# EasyEDA Pro project 嵌赛底板.eprj

# Schematic Schematic1
Create Date: 2024-06-25; Page Name: P1; Project Name: 嵌赛底板; Schematic Name: Schematic1; Update Date: 2024-06-25; Company: 嘉立创EDA; Page Size: A4; Version: V1.0
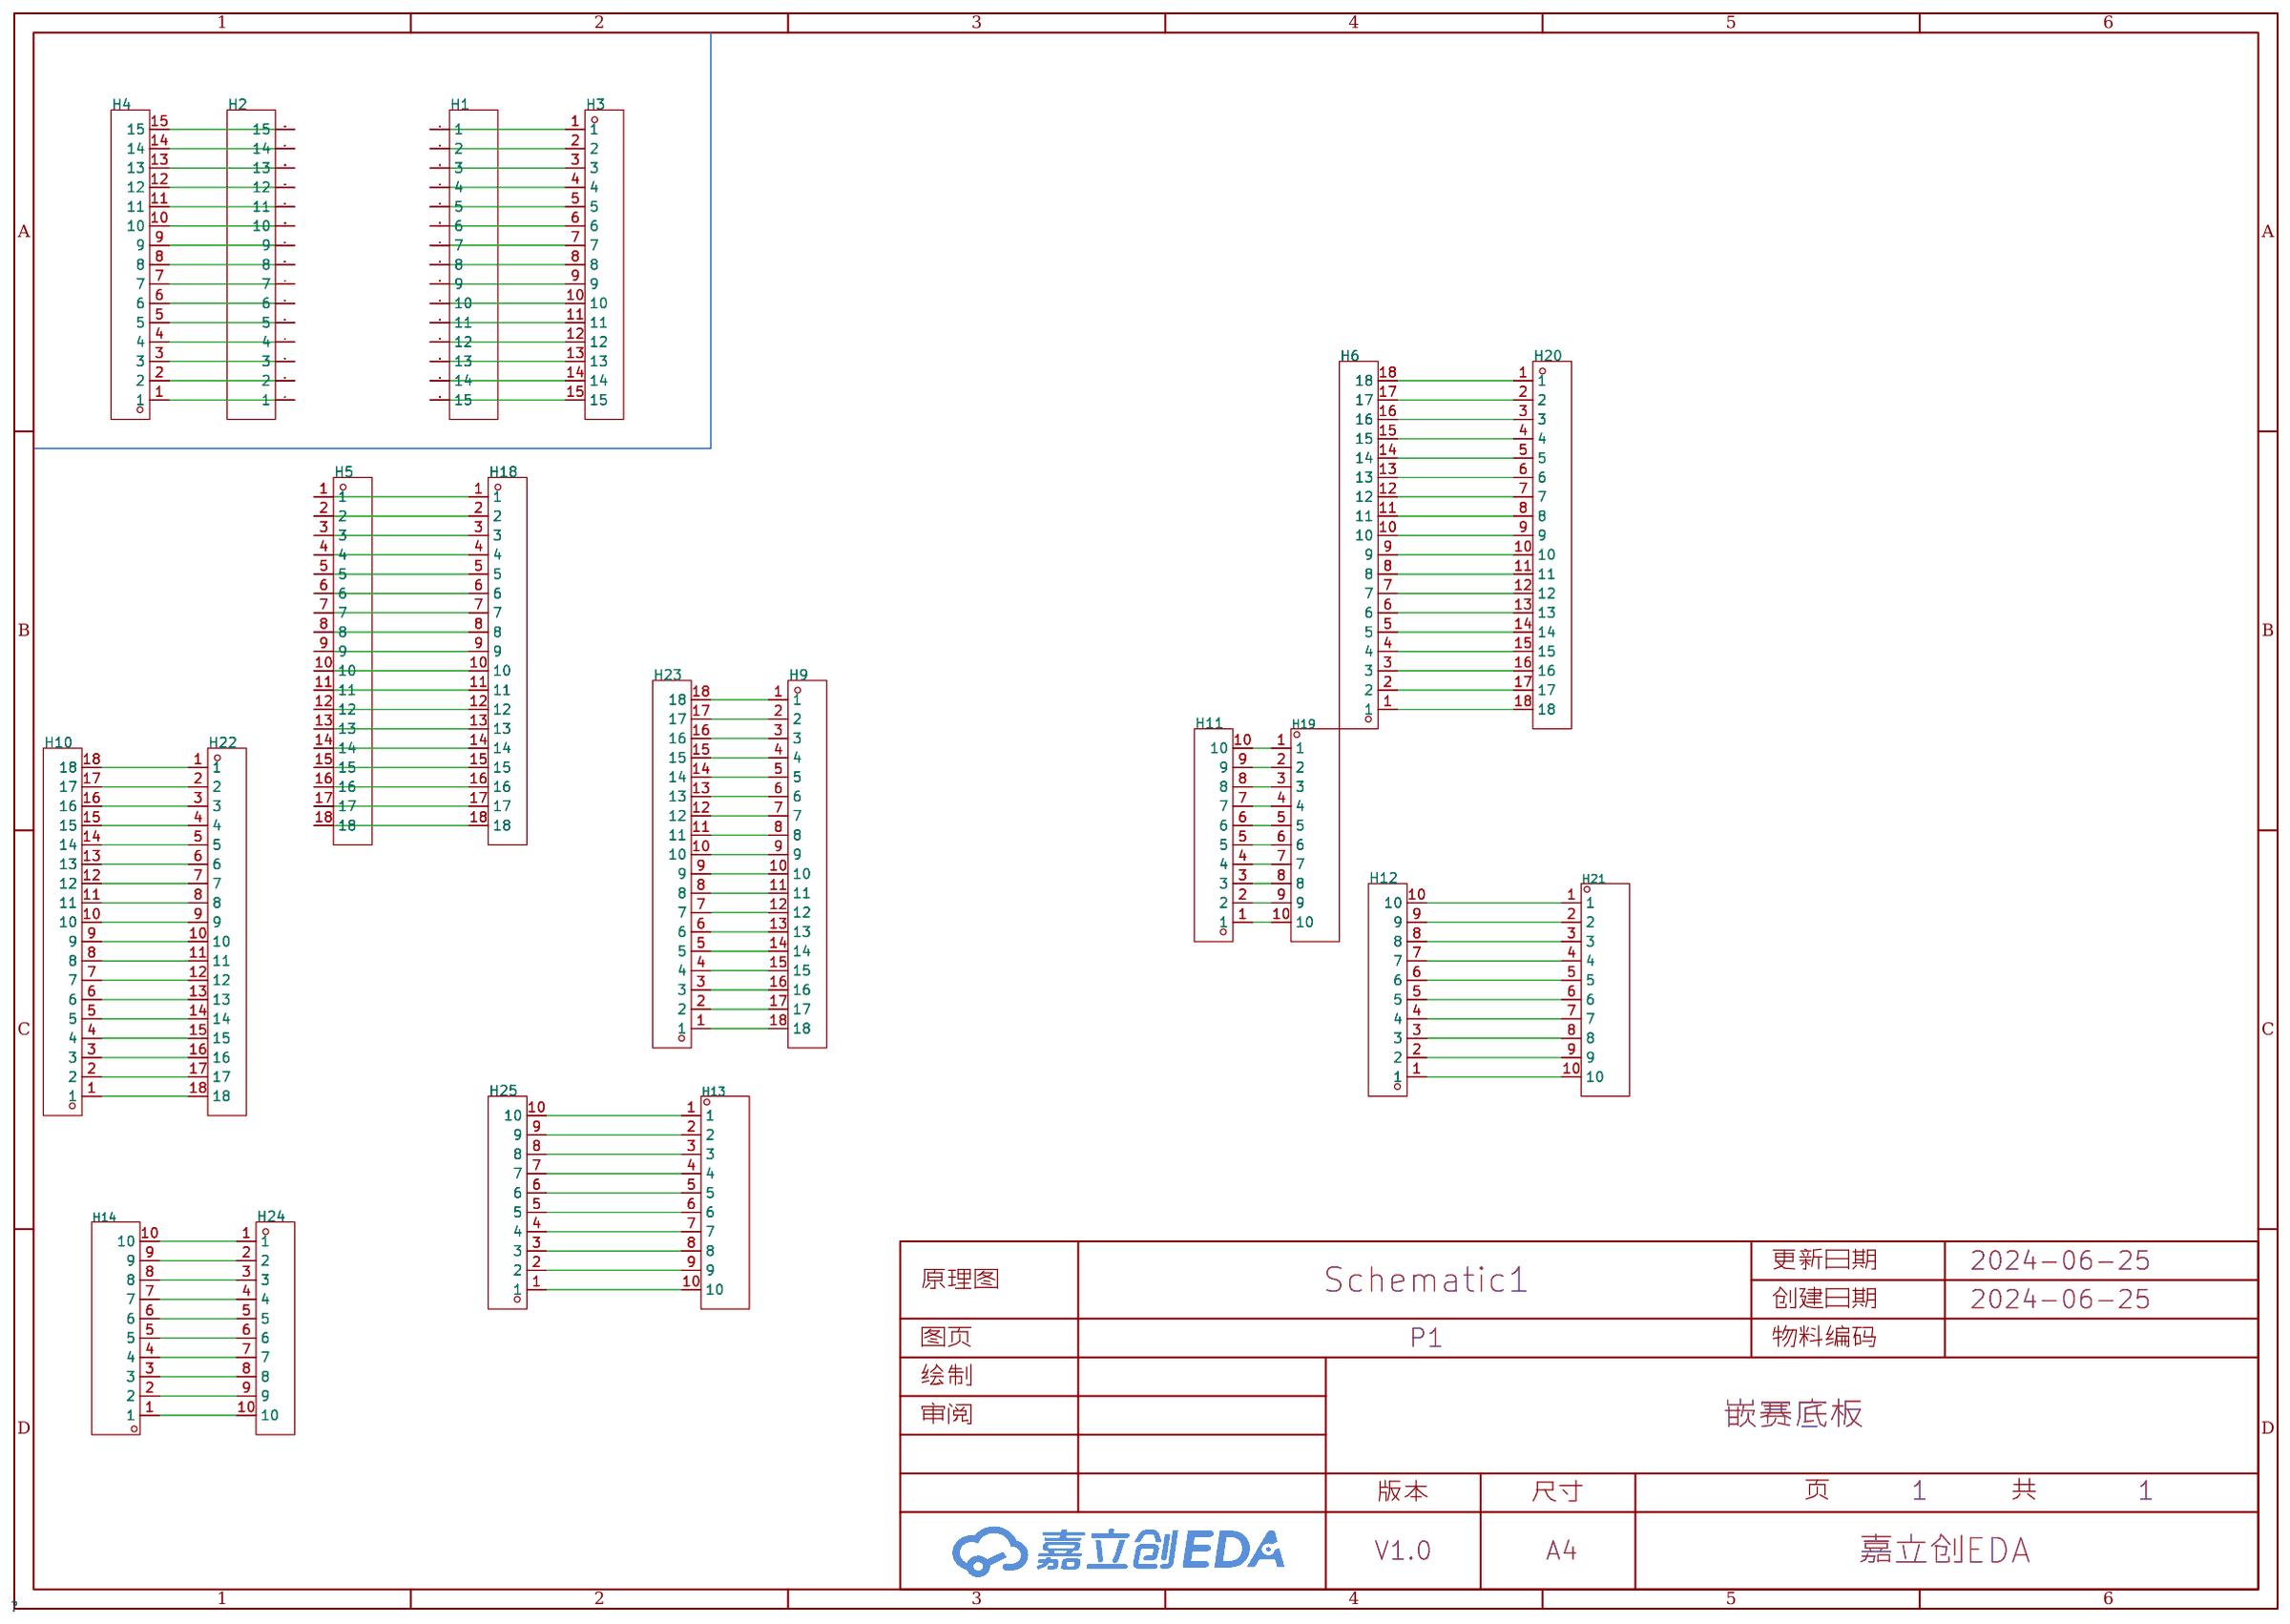
[diagram p0: schematic sheet]

## Parts
H1  -  [HDR-TH_15P-P2.54-V-F-1]
H2  -  [HDR-TH_15P-P2.54-V-F-1]
H3  -  [HDR-TH_15P-P2.54-V-M]
H4  -  [HDR-TH_15P-P2.54-V-M]
H5  -  [HDR-TH_18P-P2.54-V-F]
H6  -  [HDR-TH_18P-P2.54-V-F]
H9  -  [HDR-TH_18P-P2.54-V-M]
H10  -  [HDR-TH_18P-P2.54-V-M]
H11  -  [HDR-TH_10P-P2.54-V-F]
H12  -  [HDR-TH_10P-P2.54-V-F]
H13  -  [HDR-TH_10P-P2.54-V-M-1]
H14  -  [HDR-TH_10P-P2.54-V-M-1]
H18  -  [HDR-TH_18P-P2.54-V-M]
H19  -  [HDR-TH_10P-P2.54-V-M-1]
H20  -  [HDR-TH_18P-P2.54-V-M]
H21  -  [HDR-TH_10P-P2.54-V-M-1]
H22  -  [HDR-TH_18P-P2.54-V-F]
H23  -  [HDR-TH_18P-P2.54-V-F]
H24  -  [HDR-TH_10P-P2.54-V-F]
H25  -  [HDR-TH_10P-P2.54-V-F]

## Library data of the parts
H1 H2 = HDR-F_2.54_1x15P: Supplier Part: C124408; Supplier Footprint: 插件,
H3 H4 = HDR-M_2.54_1x15P: 间距:2.54mm;总PIN位数:15;排数:1;插针结构:1x15P;行距:-;安装类型:直插;圆针/方针:-;额定电流:-;额定电压:-;配合针长度:6mm;塑高:2.54mm;端接针长度:3mm;触头材质:黄铜;触头镀层:-;工作温度范围:-40℃~+105℃;颜色:黑色;; Supplier Part: C124373; Supplier Footprint: 插件
H5 H6 H22 H23 = HDR-F_2.54_1x18P: Supplier Part: C2897381; Supplier Footprint: 插件
H9 H10 H18 H20 = HDR-M_2.54_1x18P: 间距:2.54mm;总PIN位数:18;排数:1;插针结构:1x18P;行距:-;安装类型:直插;圆针/方针:方针;额定电流:3A;额定电压:-;配合针长度:6mm;塑高:2.5mm;端接针长度:3mm;触头材质:-;工作温度范围:-40℃~+105℃;颜色:黑色;; Supplier Part: C2894941; Supplier Footprint: 插件
H11 H12 H24 H25 = HDR-F_2.54_1x10P: Supplier Part: C2684744; Supplier Footprint: 插件
H13 H14 H19 H21 = HDR-M_2.54_1x10P: Supplier Part: C57369; Supplier Footprint: 插件

## Nets
$1N883: H1.1 H3.1
$1N885: H1.2 H3.2
$1N887: H1.3 H3.3
$1N889: H1.4 H3.4
$1N891: H1.5 H3.5
$1N893: H1.6 H3.6
$1N895: H1.7 H3.7
$1N897: H1.8 H3.8
$1N899: H1.9 H3.9
$1N901: H1.10 H3.10
$1N903: H1.11 H3.11
$1N905: H1.12 H3.12
$1N907: H1.13 H3.13
$1N909: H1.14 H3.14
$1N911: H1.15 H3.15
$1N913: H2.1 H4.1
$1N915: H2.2 H4.2
$1N917: H2.3 H4.3
$1N919: H2.4 H4.4
$1N921: H2.5 H4.5
$1N923: H2.6 H4.6
$1N925: H2.7 H4.7
$1N927: H2.8 H4.8
$1N929: H2.9 H4.9
$1N931: H2.10 H4.10
$1N933: H2.11 H4.11
$1N935: H2.12 H4.12
$1N937: H2.13 H4.13
$1N939: H2.14 H4.14
$1N941: H2.15 H4.15
$1N2451: H5.1 H18.1
$1N2453: H5.2 H18.2
$1N2455: H5.3 H18.3
$1N2457: H5.4 H18.4
$1N2459: H5.5 H18.5
$1N2461: H5.6 H18.6
$1N2463: H5.7 H18.7
$1N2465: H5.8 H18.8
$1N2467: H5.9 H18.9
$1N2469: H5.10 H18.10
$1N2471: H5.11 H18.11
$1N2473: H5.12 H18.12
$1N2475: H5.13 H18.13
$1N2477: H5.14 H18.14
$1N2479: H5.15 H18.15
$1N2481: H5.16 H18.16
$1N2483: H5.17 H18.17
$1N2485: H5.18 H18.18
$1N2853: H9.1 H23.18
$1N2855: H9.2 H23.17
$1N2857: H9.3 H23.16
$1N2859: H9.4 H23.15
$1N2861: H9.5 H23.14
$1N2863: H9.6 H23.13
$1N2865: H9.7 H23.12
$1N2867: H9.8 H23.11
$1N2869: H9.9 H23.10
$1N2871: H9.10 H23.9
$1N2873: H9.11 H23.8
$1N2875: H9.12 H23.7
$1N2877: H9.13 H23.6
$1N2879: H9.14 H23.5
$1N2881: H9.15 H23.4
$1N2883: H9.16 H23.3
$1N2885: H9.17 H23.2
$1N2887: H9.18 H23.1
$1N2909: H11.1 H19.10
$1N2911: H11.2 H19.9
$1N2913: H11.3 H19.8
$1N2915: H11.4 H19.7
$1N2917: H11.5 H19.6
$1N2919: H11.6 H19.5
$1N2921: H11.7 H19.4
$1N2923: H11.8 H19.3
$1N2925: H11.9 H19.2
$1N2927: H11.10 H19.1
$1N2929: H13.10 H25.1
$1N2931: H13.9 H25.2
$1N2933: H13.8 H25.3
$1N2935: H13.7 H25.4
$1N2937: H13.6 H25.5
$1N2939: H13.5 H25.6
$1N2941: H13.4 H25.7
$1N2943: H13.3 H25.8
$1N2945: H13.2 H25.9
$1N2947: H13.1 H25.10
$1N2976: H14.10 H24.1
$1N2978: H14.9 H24.2
$1N2980: H14.8 H24.3
$1N2982: H14.7 H24.4
$1N2984: H14.6 H24.5
$1N2986: H14.5 H24.6
$1N2988: H14.4 H24.7
$1N2990: H14.3 H24.8
$1N2992: H14.2 H24.9
$1N2994: H14.1 H24.10
$1N3028: H12.1 H21.10
$1N3030: H12.2 H21.9
$1N3032: H12.3 H21.8
$1N3034: H12.4 H21.7
$1N3036: H12.5 H21.6
$1N3038: H12.6 H21.5
$1N3040: H12.7 H21.4
$1N3042: H12.8 H21.3
$1N3044: H12.9 H21.2
$1N3046: H12.10 H21.1
$1N3048: H6.18 H20.1
$1N3050: H6.17 H20.2
$1N3052: H6.16 H20.3
$1N3054: H6.15 H20.4
$1N3056: H6.14 H20.5
$1N3058: H6.13 H20.6
$1N3060: H6.12 H20.7
$1N3062: H6.11 H20.8
$1N3064: H6.10 H20.9
$1N3066: H6.9 H20.10
$1N3068: H6.8 H20.11
$1N3070: H6.7 H20.12
$1N3072: H6.6 H20.13
$1N3074: H6.5 H20.14
$1N3076: H6.4 H20.15
$1N3078: H6.3 H20.16
$1N3080: H6.2 H20.17
$1N3082: H6.1 H20.18
$1N3084: H10.1 H22.18
$1N3086: H10.2 H22.17
$1N3088: H10.3 H22.16
$1N3090: H10.4 H22.15
$1N3092: H10.5 H22.14
$1N3094: H10.6 H22.13
$1N3096: H10.7 H22.12
$1N3098: H10.8 H22.11
$1N3100: H10.9 H22.10
$1N3102: H10.10 H22.9
$1N3104: H10.11 H22.8
$1N3106: H10.12 H22.7
$1N3108: H10.13 H22.6
$1N3110: H10.14 H22.5
$1N3112: H10.15 H22.4
$1N3114: H10.16 H22.3
$1N3116: H10.17 H22.2
$1N3118: H10.18 H22.1

# Board PCB1
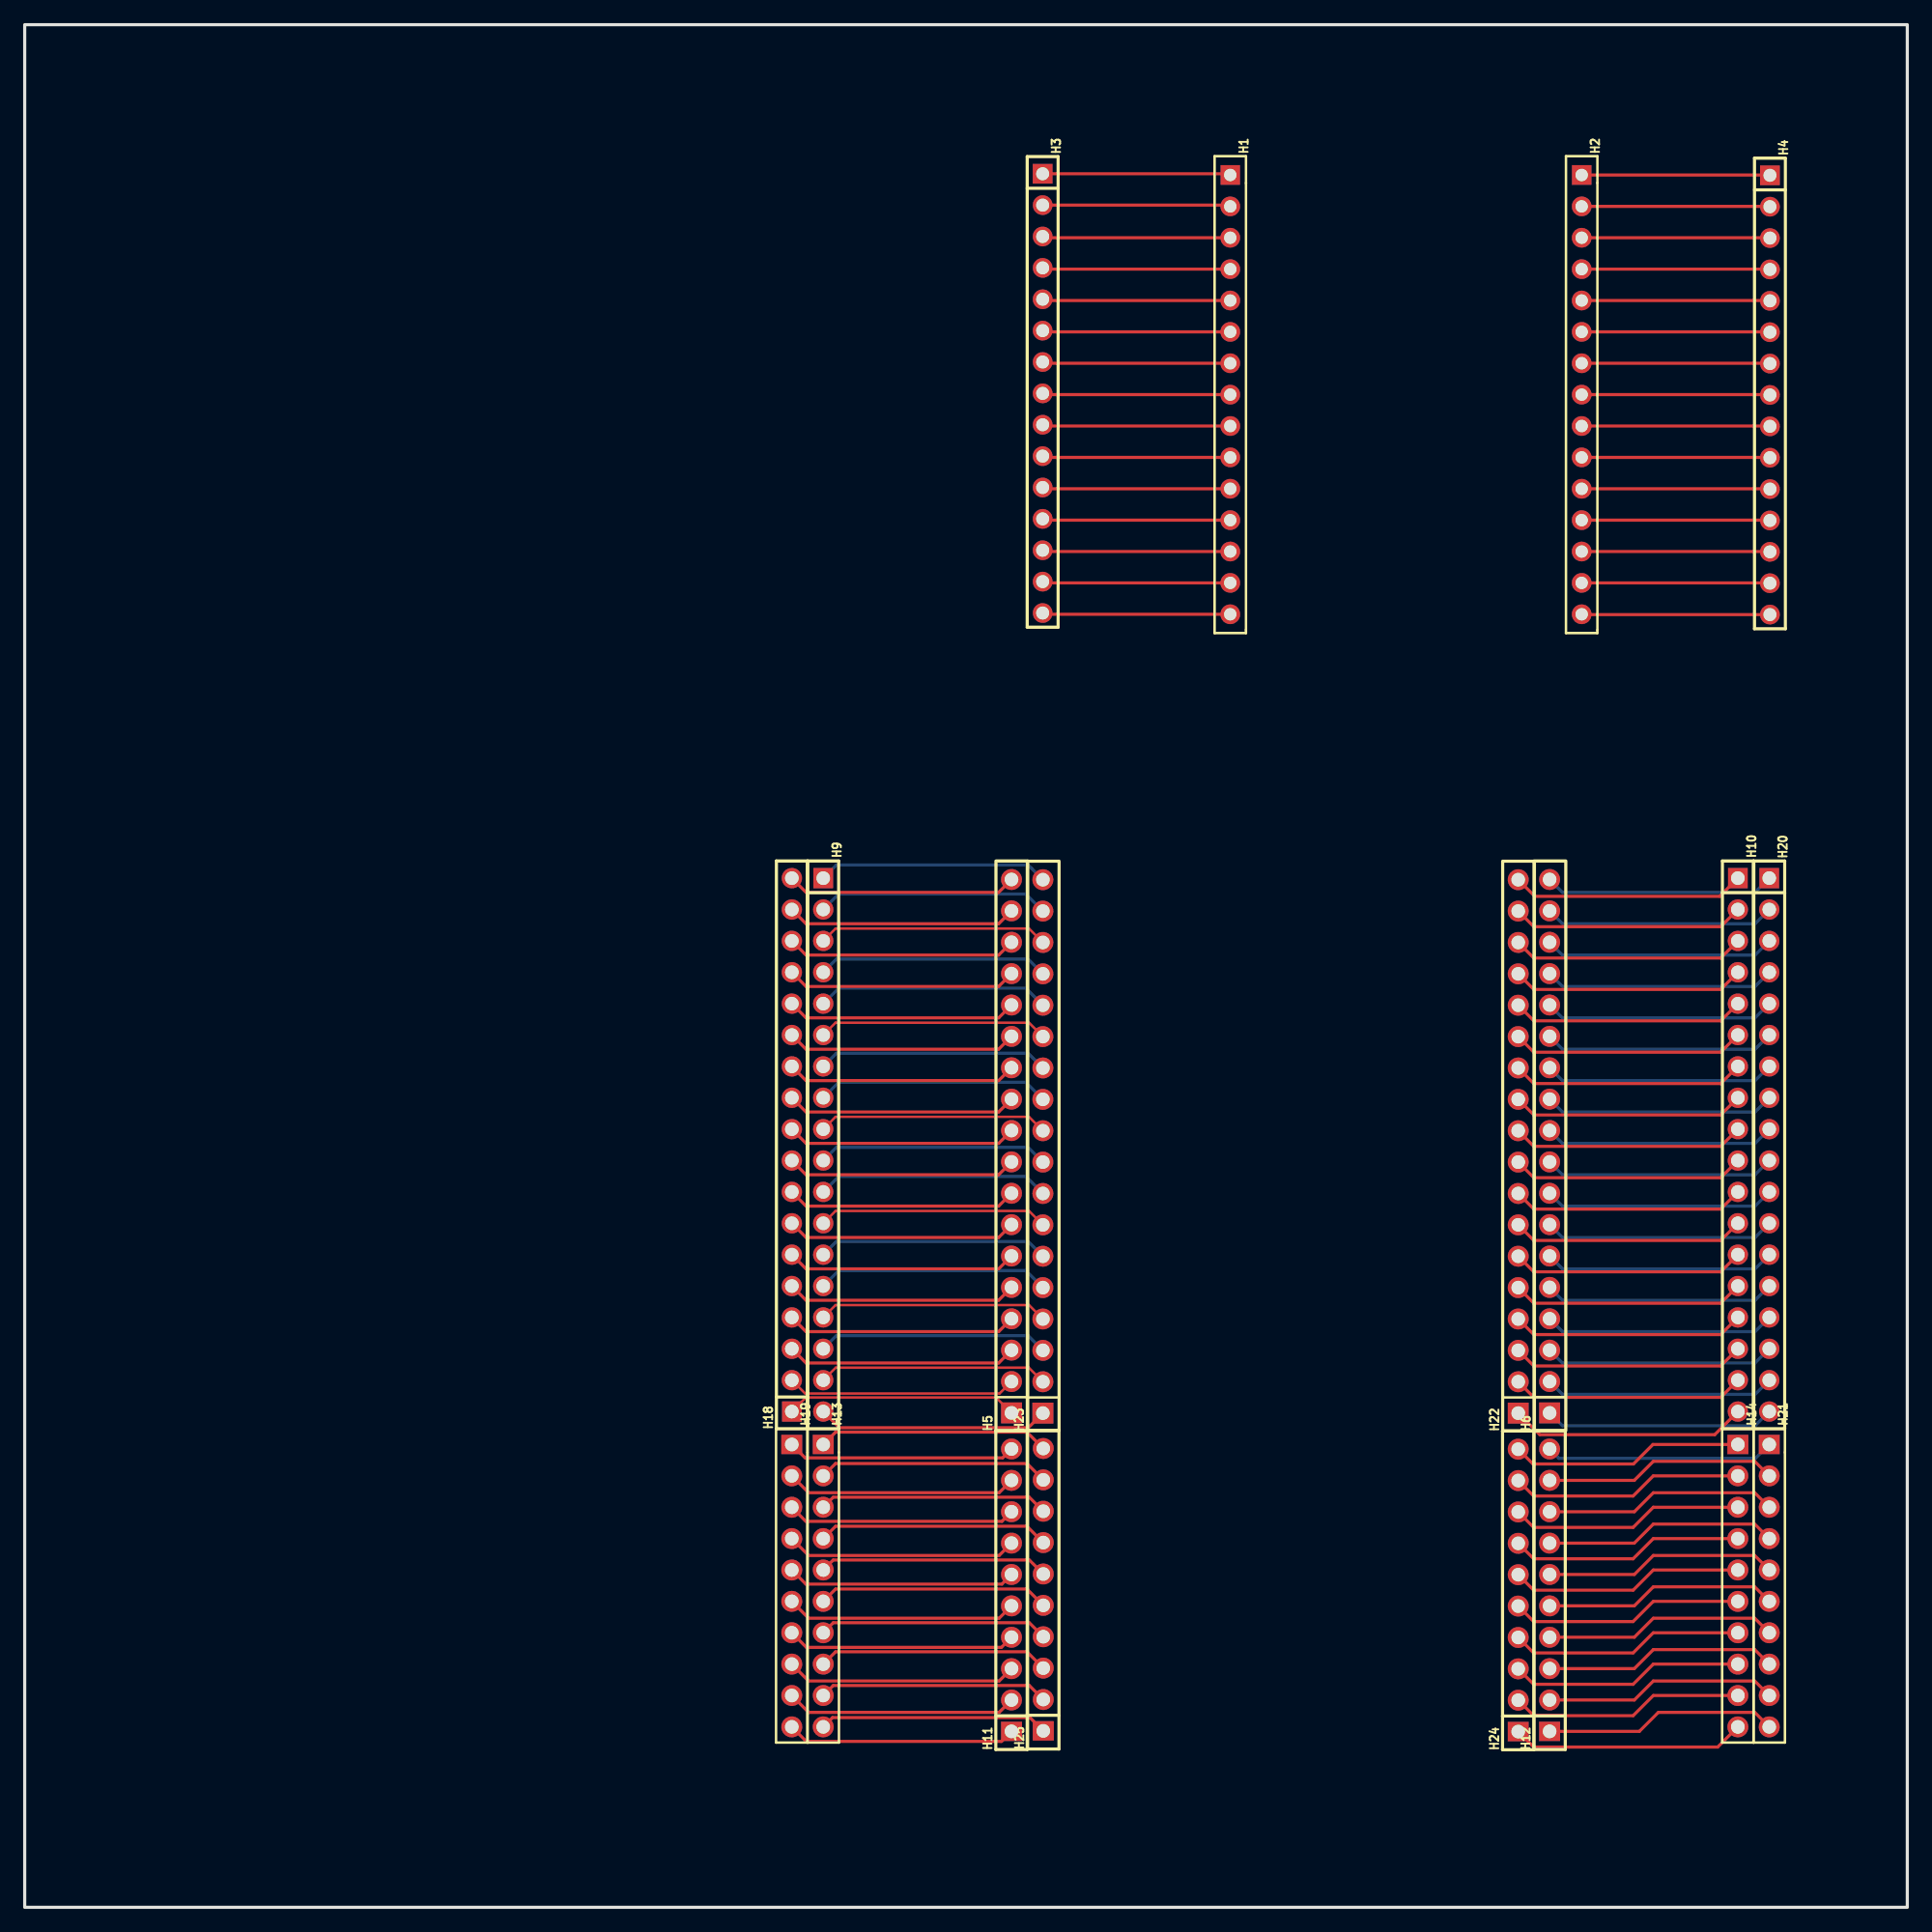
[diagram p1: board, top side]
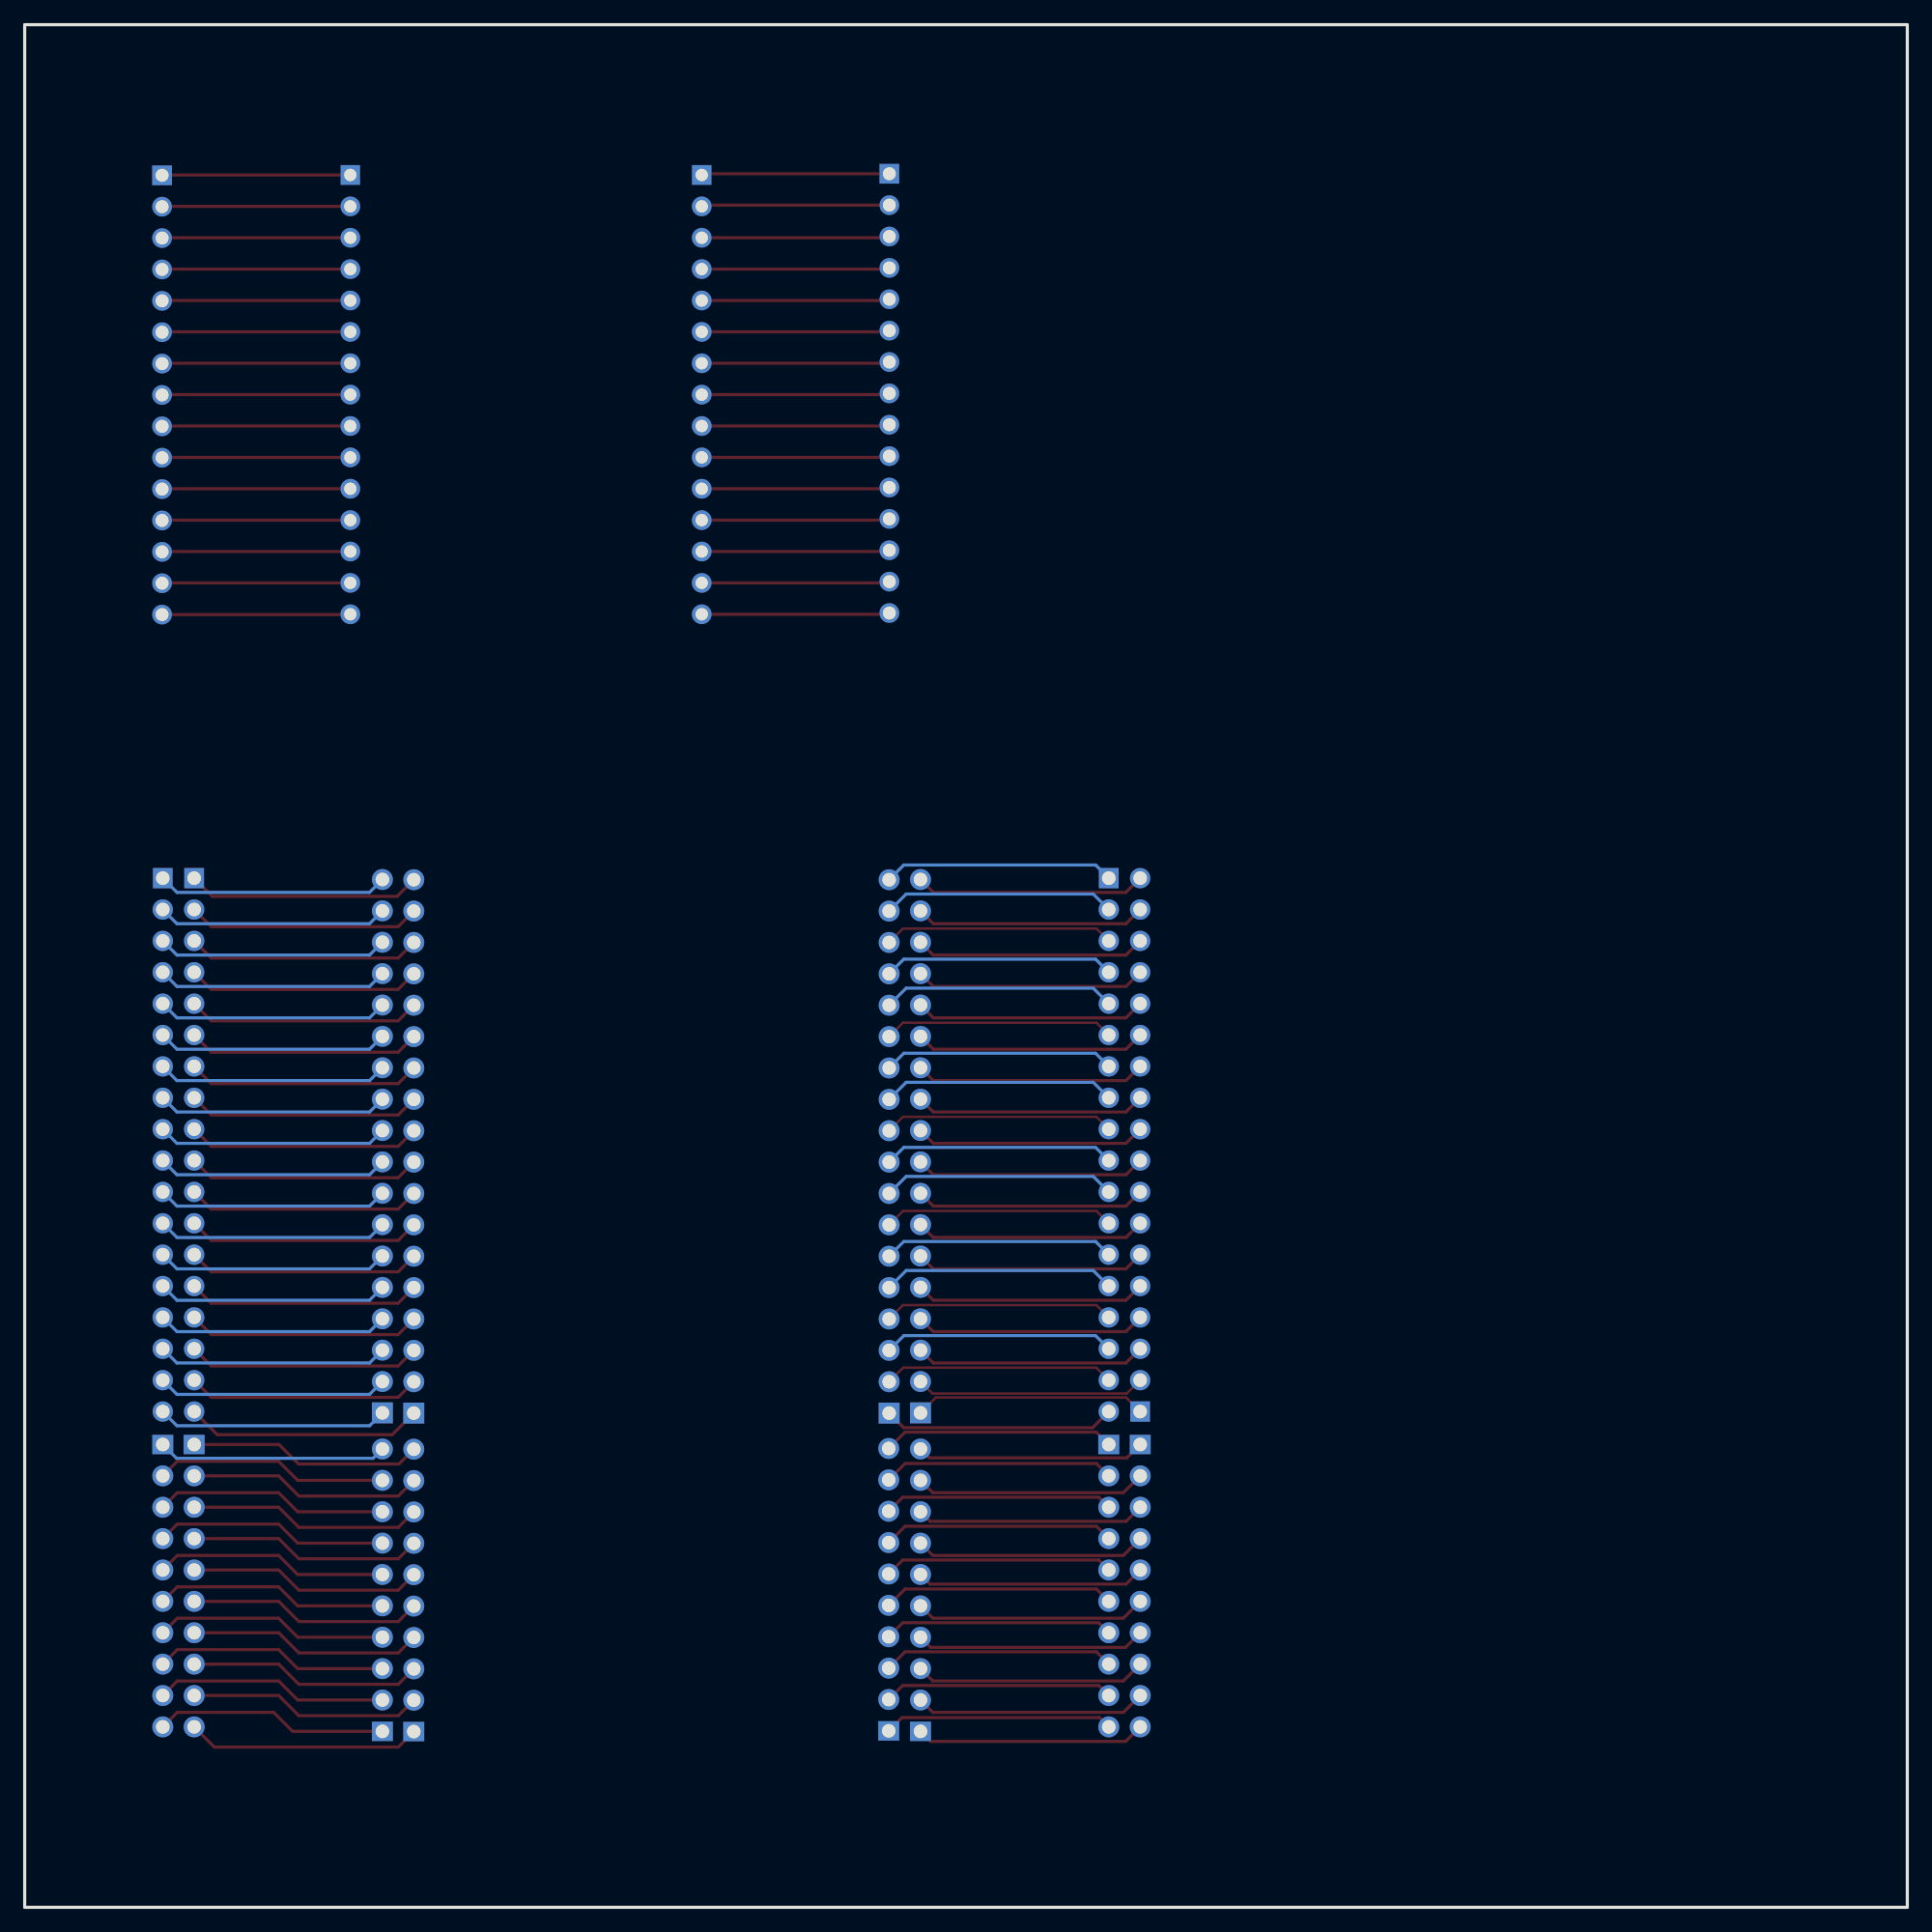
[diagram p2: board, bottom side, seen from below]

Outline 152.4 x 152.4 mm; copper layers: Top Layer, Bottom Layer. Coordinates in mm from the lower left corner of the outline.
Outline path: rectangle 0,152.4 152.4,0
Stack: Top Layer 0.035mm / Dielectric1 1.51mm FR4 er 4.5 / Bottom Layer 0.035mm

## Design rules (mm)
template: JLCPCB Capability(Two Layers Board)
spacing copperThickness1oz (default): track to track 0.102, other pairs 0.152 to 0.3
spacing copperThickness2oz: track to track 0.203, other pairs 0.152 to 0.3
track width copperThickness1oz (default): min 0.127, default 0.254, max 2.54
track width copperThickness2oz: min 0.203, default 0.254, max 2.54
differential pair differentialPair (default): width min 0.127, default 0.254, max 2.54; gap min 0.152, default 0.152
via viaSize (default): diameter min 0.5, default 0.61, max 10; hole min 0.3, default 0.305, max 6.3

## Placement (name value [footprint] x y rotation side)
H1  -  [HDR-TH_15P-P2.54-V-F-1]  97.59 122.45 270 top
H2  -  [HDR-TH_15P-P2.54-V-F-1]  126.04 122.45 270 top
H3  -  [HDR-TH_15P-P2.54-V-M]  82.41 122.55 270 top
H4  -  [HDR-TH_15P-P2.54-V-M]  141.28 122.43 270 top
H5  -  [HDR-TH_18P-P2.54-V-F]  79.88 61.61 90 top
H6  -  [HDR-TH_18P-P2.54-V-F]  123.44 61.61 90 top
H9  -  [HDR-TH_18P-P2.54-V-M]  64.64 61.72 270 top
H10  -  [HDR-TH_18P-P2.54-V-M]  138.68 61.72 270 top
H11  -  [HDR-TH_10P-P2.54-V-F]  79.88 25.67 90 top
H12  -  [HDR-TH_10P-P2.54-V-F]  123.44 25.67 90 top
H13  -  [HDR-TH_10P-P2.54-V-M-1]  64.64 26.03 270 top
H14  -  [HDR-TH_10P-P2.54-V-M-1]  138.68 26.03 270 top
H18  -  [HDR-TH_18P-P2.54-V-M]  62.1 61.72 90 top
H19  -  [HDR-TH_10P-P2.54-V-M-1]  62.1 26.04 270 top
H20  -  [HDR-TH_18P-P2.54-V-M]  141.22 61.72 270 top
H21  -  [HDR-TH_10P-P2.54-V-M-1]  141.22 26.03 270 top
H22  -  [HDR-TH_18P-P2.54-V-F]  120.9 61.59 90 top
H23  -  [HDR-TH_18P-P2.54-V-F]  82.42 61.59 90 top
H24  -  [HDR-TH_10P-P2.54-V-F]  120.9 25.65 90 top
H25  -  [HDR-TH_10P-P2.54-V-F]  82.46 25.71 90 top

## Footprints (pads in the part's own frame, mm; a bottom-side part is the same pattern mirrored in y, then rotated)
HDR-TH_10P-P2.54-V-F
  rect 1.575x1.7 hole 1.1: 1(-11.43,0)
  round 1.7 hole 1.1: 2(-8.89,0) 3(-6.35,0) 4(-3.81,0) 5(-1.27,0) 6(1.27,0) 7(3.81,0) 8(6.35,0) 9(8.89,0) 10(11.43,0)
HDR-TH_10P-P2.54-V-M-1
  rect 1.575x1.7 hole 1.1: 1(-11.43,0)
  round 1.7 hole 1.1: 2(-8.89,0) 3(-6.35,0) 4(-3.81,0) 5(-1.27,0) 6(1.27,0) 7(3.81,0) 8(6.35,0) 9(8.89,0) 10(11.43,0)
HDR-TH_15P-P2.54-V-F-1
  rect 1.6x1.575 hole 1: 1(-17.78,0)
  round 1.6 hole 1: 2(-15.24,0) 3(-12.7,0) 4(-10.16,0) 5(-7.62,0) 6(-5.08,0) 7(-2.54,0) 8(0,0) 9(2.54,0) 10(5.08,0) 11(7.62,0) 12(10.16,0) 13(12.7,0) 14(15.24,0) 15(17.78,0)
HDR-TH_15P-P2.54-V-M
  rect 1.6x1.6 hole 1.05: 1(-17.78,0)
  round 1.6 hole 1.05: 2(-15.24,0) 3(-12.7,0) 4(-10.16,0) 5(-7.62,0) 6(-5.08,0) 7(-2.54,0) 8(0,0) 9(2.54,0) 10(5.08,0) 11(7.62,0) 12(10.16,0) 13(12.7,0) 14(15.24,0) 15(17.78,0)
HDR-TH_18P-P2.54-V-F
  rect 1.7x1.7 hole 1.1: 1(-21.59,0)
  round 1.7 hole 1.1: 2(-19.05,0) 3(-16.51,0) 4(-13.97,0) 5(-11.43,0) 6(-8.89,0) 7(-6.35,0) 8(-3.81,0) 9(-1.27,0) 10(1.27,0) 11(3.81,0) 12(6.35,0) 13(8.89,0) 14(11.43,0) 15(13.97,0) 16(16.51,0) 17(19.05,0) 18(21.59,0)
HDR-TH_18P-P2.54-V-M
  rect 1.65x1.6 hole 1.1: 1(-21.59,0)
  round 1.65 hole 1.1: 2(-19.05,0) 3(-16.51,0) 4(-13.97,0) 5(-11.43,0) 6(-8.89,0) 7(-6.35,0) 8(-3.81,0) 9(-1.27,0) 10(1.27,0) 11(3.81,0) 12(6.35,0) 13(8.89,0) 14(11.43,0) 15(13.97,0) 16(16.51,0) 17(19.05,0) 18(21.59,0)

## Nets
As in the schematic.

## Routing (per net, layer and track width the routed paths; a pad name or vN(x,y) marks a point on that pad's centre or on a via; arc(x,y) is an arc through that point)
$1N883: length 15.2
  Top Layer w0.254: H1.1 97.49,140.33 H3.1
$1N885: length 15.2
  Top Layer w0.254: H3.2 97.49,137.79 H1.2
$1N887: length 15.2
  Top Layer w0.254: H1.3 82.51,135.15 H3.3
$1N889: length 15.2
  Top Layer w0.254: H3.4 82.51,132.61 H1.4
$1N891: length 15.2
  Top Layer w0.254: H3.5 82.51,130.07 H1.5
$1N893: length 15.2
  Top Layer w0.254: H1.6 82.51,127.53 H3.6
$1N895: length 15.2
  Top Layer w0.254: H3.7 82.51,124.99 H1.7
$1N897: length 15.2
  Top Layer w0.254: H1.8 82.51,122.45 H3.8
$1N899: length 15.2
  Top Layer w0.254: H1.9 82.51,119.91 H3.9
$1N901: length 15.2
  Top Layer w0.254: H3.10 82.51,117.37 H1.10
$1N903: length 15.2
  Top Layer w0.254: H1.11 82.51,114.83 H3.11
$1N905: length 15.2
  Top Layer w0.254: H1.12 82.51,112.29 H3.12
$1N907: length 15.2
  Top Layer w0.254: H3.13 82.51,109.75 H1.13
$1N909: length 15.2
  Top Layer w0.254: H1.14 82.51,107.21 H3.14
$1N911: length 15.2
  Top Layer w0.254: H1.15 82.51,104.67 H3.15
$1N913: length 15.3
  Top Layer w0.254: H2.1 141.26,140.23 H4.1
$1N915: length 15.3
  Top Layer w0.254: H2.2 141.26,137.69 H4.2
$1N917: length 15.3
  Top Layer w0.254: H2.3 141.26,135.15 H4.3
$1N919: length 15.3
  Top Layer w0.254: H2.4 141.26,132.61 H4.4
$1N921: length 15.3
  Top Layer w0.254: H4.5 141.26,130.07 H2.5
$1N923: length 15.3
  Top Layer w0.254: H4.6 141.26,127.53 H2.6
$1N925: length 15.3
  Top Layer w0.254: H2.7 141.26,124.99 H4.7
$1N927: length 15.3
  Top Layer w0.254: H2.8 141.26,122.45 H4.8
$1N929: length 15.3
  Top Layer w0.254: H4.9 141.26,119.91 H2.9
$1N931: length 15.3
  Top Layer w0.254: H2.10 141.26,117.37 H4.10
$1N933: length 15.3
  Top Layer w0.254: H4.11 141.26,114.83 H2.11
$1N935: length 15.3
  Top Layer w0.254: H4.12 141.26,112.29 H2.12
$1N937: length 15.3
  Top Layer w0.254: H2.13 141.26,109.75 H4.13
$1N939: length 15.3
  Top Layer w0.254: H4.14 141.26,107.21 H2.14
$1N941: length 15.3
  Top Layer w0.254: H4.15 126.07,104.65 H2.15
$1N2451: length 18.8
  Top Layer w0.203: H18.1 63.25,41.28 78.63,41.28 H5.1
$1N2453: length 18.6
  Top Layer w0.203: H18.2 63.18,41.59 78.91,41.59 H5.2
$1N2455: length 18.7
  Top Layer w0.254: H18.3 63.25,44.06 78.84,44.06 H5.3
$1N2457: length 18.7
  Top Layer w0.254: H5.4 78.84,46.6 63.25,46.6 62.1,47.75
$1N2459: length 18.7
  Top Layer w0.254: H5.5 78.84,49.14 63.25,49.14 H18.5
$1N2461: length 18.7
  Top Layer w0.254: H18.6 63.25,51.68 78.84,51.68 H5.6
$1N2463: length 18.7
  Top Layer w0.254: H18.7 63.25,54.22 78.84,54.22 H5.7
$1N2465: length 18.7
  Top Layer w0.254: H5.8 78.84,56.76 63.25,56.76 H18.8
$1N2467: length 18.7
  Top Layer w0.254: H18.9 63.25,59.3 78.84,59.3 H5.9
$1N2469: length 18.7
  Top Layer w0.254: H5.10 78.84,61.84 63.25,61.84 H18.10
$1N2471: length 18.7
  Top Layer w0.254: H5.11 78.84,64.38 63.25,64.38 H18.11
$1N2473: length 18.7
  Top Layer w0.254: H5.12 78.84,66.92 63.25,66.92 62.1,68.07
$1N2475: length 18.7
  Top Layer w0.254: H18.13 63.25,69.46 78.84,69.46 H5.13
$1N2477: length 18.7
  Top Layer w0.254: H5.14 78.84,72 63.25,72 62.1,73.15
$1N2479: length 18.7
  Top Layer w0.254: H5.15 78.84,74.54 63.25,74.54 H18.15
$1N2481: length 18.7
  Top Layer w0.254: H5.16 78.84,77.08 63.25,77.08 H18.16
$1N2483: length 18.7
  Top Layer w0.254: H5.17 78.84,79.62 63.25,79.62 H18.17
$1N2485: length 18.7
  Top Layer w0.254: H5.18 78.84,82.16 63.26,82.16 H18.18
$1N2853: length 18.7
  Bottom Layer w0.254: H23.18 81.23,84.38 65.71,84.38 H9.1
$1N2855: length 18.9
  Bottom Layer w0.254: H23.17 81.04,82.03 65.9,82.03 H9.2
$1N2857: length 18.7
  Top Layer w0.203: H9.3 65.64,79.23 81.3,79.23 H23.16
$1N2859: length 18.7
  Bottom Layer w0.254: H9.4 65.71,76.76 81.23,76.76 H23.15
$1N2861: length 18.9
  Bottom Layer w0.254: H23.14 81.04,74.41 65.9,74.41 64.64,73.15
$1N2863: length 18.7
  Top Layer w0.203: H23.13 81.3,71.61 65.64,71.61 H9.6
$1N2865: length 18.7
  Bottom Layer w0.254: 64.64,68.07 65.71,69.14 81.23,69.14 H23.12
$1N2867: length 18.9
  Bottom Layer w0.254: H9.8 65.9,66.79 81.04,66.79 H23.11
$1N2869: length 18.7
  Top Layer w0.203: H23.10 81.3,63.99 65.64,63.99 H9.9
$1N2871: length 18.7
  Bottom Layer w0.254: H23.9 81.23,61.52 65.71,61.52 H9.10
$1N2873: length 18.9
  Bottom Layer w0.254: H9.11 65.9,59.17 81.04,59.17 H23.8
$1N2875: length 18.7
  Top Layer w0.203: H9.12 65.64,56.37 81.3,56.37 H23.7
$1N2877: length 18.7
  Bottom Layer w0.254: H9.13 65.71,53.9 81.23,53.9 H23.6
$1N2879: length 18.9
  Bottom Layer w0.254: H9.14 65.9,51.55 81.04,51.55 H23.5
$1N2881: length 18.7
  Top Layer w0.203: H23.4 81.3,48.75 65.64,48.75 64.64,47.75
$1N2883: length 18.7
  Bottom Layer w0.254: H23.3 81.23,46.28 65.71,46.28 H9.16
$1N2885: length 18.7
  Top Layer w0.203: H9.17 65.66,43.69 81.28,43.69 H23.2
$1N2887: length 18.8
  Top Layer w0.254: H23.1 81.24,38.82 65.95,38.82 H9.18
$1N2909: length 18.6
  Top Layer w0.254: H19.10 63.27,13.43 79.07,13.43 H11.1
$1N2911: length 18.8
  Top Layer w0.254: H19.9 63.46,15.78 78.88,15.78 H11.2
$1N2913: length 18.8
  Top Layer w0.254: H11.3 78.88,18.32 63.46,18.32 H19.8
$1N2915: length 18.6
  Top Layer w0.254: H11.4 79.06,21.04 63.28,21.04 H19.7
$1N2917: length 18.8
  Top Layer w0.254: H11.5 78.88,23.4 63.46,23.4 H19.6
$1N2919: length 18.6
  Top Layer w0.254: H11.6 79.1,26.16 63.24,26.16 62.1,27.31
$1N2921: length 18.8
  Top Layer w0.254: H11.7 78.88,28.48 63.46,28.48 H19.4
$1N2923: length 18.6
  Top Layer w0.254: H19.3 63.24,31.24 79.1,31.24 H11.8
$1N2925: length 18.8
  Top Layer w0.254: H11.9 78.88,33.56 63.46,33.56 62.1,34.93
$1N2927: length 18.5
  Top Layer w0.254: H19.1 63.18,36.38 79.17,36.38 H11.10
$1N2929: length 18.6
  Top Layer w0.254: H13.10 65.4,15.36 81.38,15.36 H25.1
$1N2931: length 18.6
  Top Layer w0.254: H13.9 65.45,17.96 81.32,17.96 H25.2
$1N2933: length 18.8
  Top Layer w0.254: H13.8 65.64,20.69 81.13,20.69 H25.3
$1N2935: length 18.6
  Top Layer w0.254: H25.4 81.32,23.04 65.45,23.04 H13.7
$1N2937: length 18.8
  Top Layer w0.254: H25.5 81.13,25.77 65.64,25.77 H13.6
$1N2939: length 18.6
  Top Layer w0.254: H13.5 65.45,28.12 81.32,28.12 H25.6
$1N2941: length 18.8
  Top Layer w0.254: H25.7 81.13,30.85 65.64,30.85 H13.4
$1N2943: length 18.6
  Top Layer w0.254: H25.8 81.32,33.2 65.45,33.2 H13.3
$1N2945: length 18.8
  Top Layer w0.254: H25.9 81.13,35.93 65.64,35.93 H13.2
$1N2947: length 18.8
  Top Layer w0.254: H13.1 65.65,38.47 81.13,38.47 H25.10
$1N2976: length 19
  Top Layer w0.254: H24.1 122.16,12.97 137.05,12.97 H14.10
$1N2978: length 19
  Top Layer w0.254: H24.2 122.16,15.51 130.2,15.51 131.84,17.15 H14.9
$1N2980: length 19
  Top Layer w0.254: H14.8 131.84,19.69 130.2,18.05 122.16,18.05 H24.3
$1N2982: length 19
  Top Layer w0.254: H14.7 131.84,22.22 130.2,20.59 122.16,20.59 H24.4
$1N2984: length 19
  Top Layer w0.254: H14.6 131.84,24.76 130.2,23.13 122.16,23.13 H24.5
$1N2986: length 19
  Top Layer w0.254: H14.5 131.84,27.31 130.2,25.67 122.16,25.67 H24.6
$1N2988: length 19
  Top Layer w0.254: H24.7 122.16,28.21 130.2,28.21 131.84,29.84 H14.4
$1N2990: length 19
  Top Layer w0.254: H14.3 131.84,32.38 130.2,30.75 122.16,30.75 H24.8
$1N2992: length 19
  Top Layer w0.254: H24.9 122.16,33.29 130.2,33.29 131.84,34.92 H14.2
$1N2994: length 18.9
  Top Layer w0.254: H24.10 122.1,35.89 130.23,35.89 131.81,37.47 H14.1
$1N3028: length 18.9
  Top Layer w0.254: H12.1 130.71,14.24 132.25,15.78 140.05,15.78 H21.10
$1N3030: length 18.9
  Top Layer w0.254: H12.2 130.3,16.78 131.84,18.32 140.05,18.32 H21.9
$1N3032: length 18.9
  Top Layer w0.254: H21.8 140.05,20.86 131.84,20.86 130.3,19.32 H12.3
$1N3034: length 18.9
  Top Layer w0.254: H21.7 140.05,23.4 131.84,23.4 130.3,21.86 H12.4
$1N3036: length 18.9
  Top Layer w0.254: H12.5 130.3,24.4 131.84,25.94 140.05,25.94 H21.6
$1N3038: length 18.9
  Top Layer w0.254: H21.5 140.05,28.48 131.84,28.48 130.3,26.94 H12.6
$1N3040: length 18.9
  Top Layer w0.254: H21.4 140.05,31.02 131.84,31.02 130.3,29.48 H12.7
$1N3042: length 18.9
  Top Layer w0.254: H21.3 140.05,33.56 131.84,33.56 130.3,32.02 H12.8
$1N3044: length 18.9
  Top Layer w0.254: H12.9 130.3,34.56 131.84,36.1 140.05,36.1 H21.2
$1N3046: length 18.6
  Bottom Layer w0.254: H21.1 140.11,36.35 124.2,36.35 H12.10
$1N3048: length 18.7
  Bottom Layer w0.254: H6.18 124.49,82.16 140.07,82.16 H20.1
$1N3050: length 18.7
  Bottom Layer w0.254: H6.17 124.48,79.62 140.07,79.62 H20.2
$1N3052: length 18.7
  Bottom Layer w0.254: H20.3 140.07,77.08 124.48,77.08 H6.16
$1N3054: length 18.7
  Bottom Layer w0.254: H20.4 140.07,74.54 124.48,74.54 H6.15
$1N3056: length 18.7
  Bottom Layer w0.254: H6.14 124.48,72 140.07,72 141.22,73.15
$1N3058: length 18.7
  Bottom Layer w0.254: H6.13 124.48,69.46 140.07,69.46 H20.6
$1N3060: length 18.7
  Bottom Layer w0.254: 141.22,68.07 140.07,66.92 124.48,66.92 H6.12
$1N3062: length 18.7
  Bottom Layer w0.254: H6.11 124.48,64.38 140.07,64.38 H20.8
$1N3064: length 18.7
  Bottom Layer w0.254: H20.9 140.07,61.84 124.48,61.84 H6.10
$1N3066: length 18.7
  Bottom Layer w0.254: H6.9 124.48,59.3 140.07,59.3 H20.10
$1N3068: length 18.7
  Bottom Layer w0.254: H6.8 124.48,56.76 140.07,56.76 H20.11
$1N3070: length 18.7
  Bottom Layer w0.254: H20.12 140.07,54.22 124.48,54.22 H6.7
$1N3072: length 18.7
  Bottom Layer w0.254: H20.13 140.07,51.68 124.48,51.68 H6.6
$1N3074: length 18.7
  Bottom Layer w0.254: H6.5 124.48,49.14 140.07,49.14 H20.14
$1N3076: length 18.7
  Bottom Layer w0.254: H6.4 124.48,46.6 140.07,46.6 141.22,47.75
$1N3078: length 18.7
  Bottom Layer w0.254: H6.3 124.48,44.06 140.07,44.06 H20.16
$1N3080: length 18.7
  Bottom Layer w0.254: H20.17 140.07,41.52 124.48,41.52 H6.2
$1N3082: length 18.7
  Bottom Layer w0.254: H20.18 140.07,38.98 124.48,38.98 H6.1
$1N3084: length 18.9
  Top Layer w0.254: H22.18 122.25,81.84 137.21,81.84 H10.1
$1N3086: length 18.9
  Top Layer w0.254: H10.2 137.29,79.38 122.17,79.38 H22.17
$1N3088: length 18.9
  Top Layer w0.254: H22.16 122.17,76.84 137.29,76.84 H10.3
$1N3090: length 18.9
  Top Layer w0.254: H22.15 122.17,74.3 137.29,74.3 H10.4
$1N3092: length 18.9
  Top Layer w0.254: H22.14 122.17,71.76 137.29,71.76 138.68,73.15
$1N3094: length 18.9
  Top Layer w0.254: H10.6 137.29,69.22 122.17,69.22 H22.13
$1N3096: length 18.9
  Top Layer w0.254: 138.68,68.07 137.29,66.68 122.17,66.68 H22.12
$1N3098: length 18.9
  Top Layer w0.254: H10.8 137.29,64.14 122.17,64.14 H22.11
$1N3100: length 18.9
  Top Layer w0.254: H22.10 122.17,61.6 137.29,61.6 H10.9
$1N3102: length 18.9
  Top Layer w0.254: H10.10 137.29,59.06 122.17,59.06 H22.9
$1N3104: length 18.9
  Top Layer w0.254: H10.11 137.29,56.52 122.17,56.52 H22.8
$1N3106: length 18.9
  Top Layer w0.254: H10.12 137.29,53.98 122.17,53.98 H22.7
$1N3108: length 18.9
  Top Layer w0.254: H22.6 122.17,51.44 137.29,51.44 H10.13
$1N3110: length 18.9
  Top Layer w0.254: H22.5 122.17,48.9 137.29,48.9 H10.14
$1N3112: length 18.9
  Top Layer w0.254: 138.68,47.75 137.29,46.36 122.17,46.36 H22.4
$1N3114: length 18.9
  Top Layer w0.254: H22.3 122.17,43.82 137.29,43.82 H10.16
$1N3116: length 18.9
  Top Layer w0.254: H22.2 122.17,41.28 137.29,41.28 H10.17
$1N3118: length 19.3
  Top Layer w0.254: H22.1 122.65,38.26 136.81,38.26 H10.18
